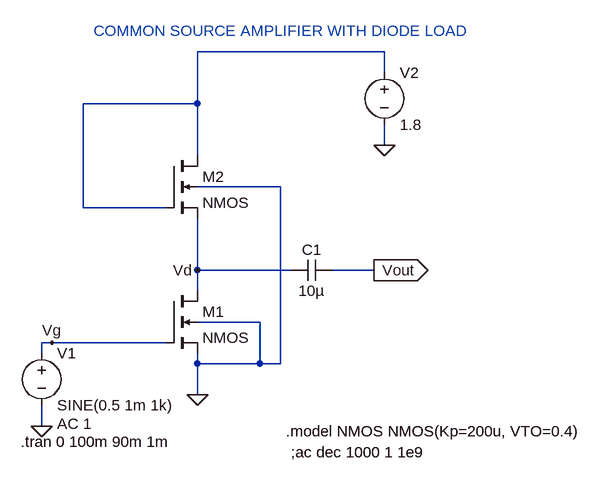
[diagram p0: schematic COMMON SOURCE AMPLIFIER WITH DIODE LOAD.asc]
COMMON SOURCE AMPLIFIER WITH DIODE LOAD.asc, the LTspice schematic file:
Version 4
SHEET 1 888 680
WIRE 560 -240 272 -240
WIRE 560 -208 560 -240
WIRE 272 -160 272 -240
WIRE 272 -160 96 -160
WIRE 560 -96 560 -128
WIRE 272 -80 272 -160
WIRE 400 -32 272 -32
WIRE 96 0 96 -160
WIRE 224 0 96 0
WIRE 272 96 272 16
WIRE 416 96 272 96
WIRE 544 96 480 96
WIRE 272 128 272 96
WIRE 368 176 272 176
WIRE 48 208 32 208
WIRE 224 208 48 208
WIRE 32 224 32 208
WIRE 272 240 272 224
WIRE 368 240 368 176
WIRE 368 240 272 240
WIRE 400 240 400 -32
WIRE 400 240 368 240
WIRE 272 288 272 240
WIRE 32 336 32 304
FLAG 32 336 0
FLAG 272 288 0
FLAG 560 -96 0
FLAG 48 208 Vg
FLAG 272 96 Vd
FLAG 544 96 Vout
IOPIN 544 96 Out
SYMBOL nmos4 224 128 R0
SYMATTR InstName M1
SYMATTR Value2 l=2u w=4u
SYMBOL nmos4 224 -80 R0
SYMATTR InstName M2
SYMATTR Value2 l=4u w=2u
SYMBOL voltage 32 208 R0
WINDOW 123 24 124 Left 2
WINDOW 39 0 0 Left 0
SYMATTR Value2 AC 1
SYMATTR InstName V1
SYMATTR Value SINE(0.5 1m 1k)
SYMBOL voltage 560 -224 R0
WINDOW 123 0 0 Left 0
WINDOW 39 0 0 Left 0
SYMATTR InstName V2
SYMATTR Value 1.8
SYMBOL cap 480 80 R90
WINDOW 0 0 32 VBottom 2
WINDOW 3 32 32 VTop 2
SYMATTR InstName C1
SYMATTR Value 10µ
TEXT 0 360 Left 2 !.tran 0 100m 90m 1m
TEXT 408 344 Left 2 !.model NMOS NMOS(Kp=200u, VTO=0.4)
TEXT 112 -272 Left 2 ;COMMON SOURCE AMPLIFIER WITH DIODE LOAD
TEXT 416 376 Left 2 !;ac dec 1000 1 1e9

The netlist it stands for:
* COMMON SOURCE AMPLIFIER WITH DIODE LOAD.asc
M1 Vd Vg 0 0 NMOS l=2u w=4u
M2 N001 N001 Vd 0 NMOS l=4u w=2u
V1 Vg 0 SINE(0.5 1m 1k) AC 1
V2 N001 0 1.8
C1 Vout Vd 10µ
.model NMOS NMOS
.model PMOS PMOS
.lib standard.mos
.tran 0 100m 90m 1m
.model NMOS NMOS(Kp=200u, VTO=0.4)
* COMMON SOURCE AMPLIFIER WITH DIODE LOAD
;ac dec 1000 1 1e9
.backanno
.end